# Altium schematic sheet STeaMi-FP15-Memoire_flash.SchDoc
size A3; DocumentNumber: 1; SheetNumber: 16; SheetTotal: 16
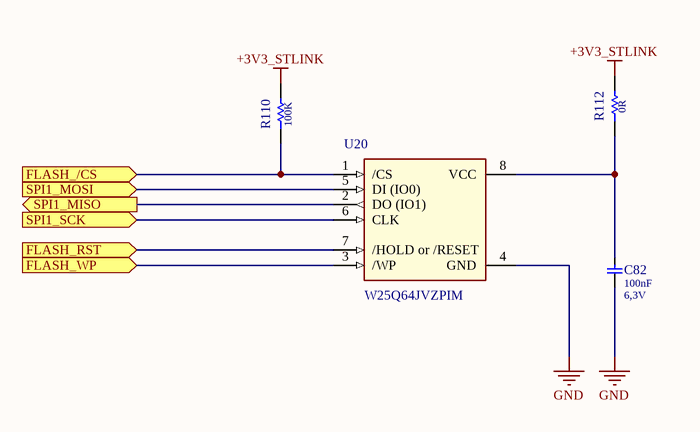
[diagram p0: STeaMi-FP15-Memoire_flash.SchDoc]

## Parts
C82  Capacitance: 100nF  Voltage: 6,3V  [0402-CAP]
R110  Resistance: 100K  [RESC1005X40N_0402]
R112  Resistance: 0R  [RESC1005X40N_0402]
U20  (no value)  [SON127P600X500X80-9N]

## Ports
FLASH_/CS (in), FLASH_RST (in), FLASH_WP (in), SPI1_MISO (out), SPI1_MOSI (in), SPI1_SCK (in)

## Nets
+3V3_STLINK: R110.2 R112.2
GND: C82.1 U20.4(GND)
FLASH_/CS: R110.1 U20.1(/CS) ; port FLASH_/CS
FLASH_RST: U20.7(/HOLD_or_/RESET) ; port FLASH_RST
FLASH_WP: U20.3(/WP) ; port FLASH_WP
SPI1_MISO: U20.2(DO_(IO1)) ; port SPI1_MISO
SPI1_MOSI: U20.5(DI_(IO0)) ; port SPI1_MOSI
SPI1_SCK: U20.6(CLK) ; port SPI1_SCK
NetC82_2: C82.2 R112.1 U20.8(VCC)

## Notes on the sheet
- Le présent document est la propriété exclusive de SmartEmbed. Remis à titre confidentiel, il ne peut être communiqué
- IND
- DATE
- DESCRIPTION
- VISA
- à des tiers, ni utilisé ou reproduit qu'en stricte conformité d'autorisations expresses préalables.
- Etabli le:
- Verifié le:
- Validé le:
- Par:
- Page:
- /
- Pépinière CleanTech Domaine du Petit Arbois Avenue Louis Philibert BP 80058 13792 AIX-EN-PROVENCE CEDEX 3
- REFERENCE
- DESIGNATION

## Library data of the parts
C82 = 100nF-10%-6,3V-X5R-0402: CAP CER 100nF 6,3V X5R 0402; Manufacturer: Kyocera AVX; Manufacturer Part Number: 0402YD104KAT2A; Populated: True; std Package: 0402; Tolerence: 0,1; Vérification: Non; Created by: EAG; Creation Date: 18/10/2021; Checked by: *; Part Number: 100nF-10%-6,3V-X5R-0402; Dielectric: X5R; Digikey: 478-1126-1-ND; Mouser: 581-0402YD104K; Switch possibility: True
R110 = 100K-5%-0,0625W-0402: RES CMS 100K5%-0,0625W-0402 ±100ppm/°C; Manufacturer: Yageo; Manufacturer Part Number: RC0402JR-07100KL; Populated: True; Power: 0,0625; Nom vérificateur: Non; Prix: 0,09; std Package: 0402; Tolerence: 0,05; Created by: EAG; Creation Date: 02/12/2021; Part Number: 100K-5%-0,0625W-0402; Digikey: 311-100KJRCT-ND; Farnell: 9233008; Switch possibility: True
R112 = 0R-5%-0,0625W-0402: RES CMS 0R5%-0,0625W-0402; Manufacturer: Yageo; Manufacturer Part Number: RC0402JR-100RL; Populated: True; Power: 0,0625; Nom vérificateur: Non; Prix: 0,09; std Package: 0402; Tolerence: 0,05; Created by: EAG; Creation Date: 02/12/2021; Part Number: 0R-5%-0,0625W-0402; Mouser: 603-RC0402JR-100RL; Switch possibility: True
U20 = W25Q64JVZPIM: FLASH - NOR Mémoire IC 64Mb (8M x 8) SPI - I/O quadruple, QPI, DTR 133MHz 6ns 8-WSON (6x5); Manufacturer: Winbond; Populated: False; Switch possibility: False; Vérification: Non; Created by: EAG; Creation Date: 29/09/2021; Checked by: *; Ambient Temperature: ='Ambient temp'; Storage temperature: ='Storage temp'; Current: *; RoHs compliant: ='Rohs'; Datasheet: ='Datasheet'; Manufacturer Part Number: W25Q64JVZPIM; Part Number: W25Q64JVZPIM; Digikey: 256-W25Q64JVZPIM-ND